# Altium project DC_controller.PrjPCB
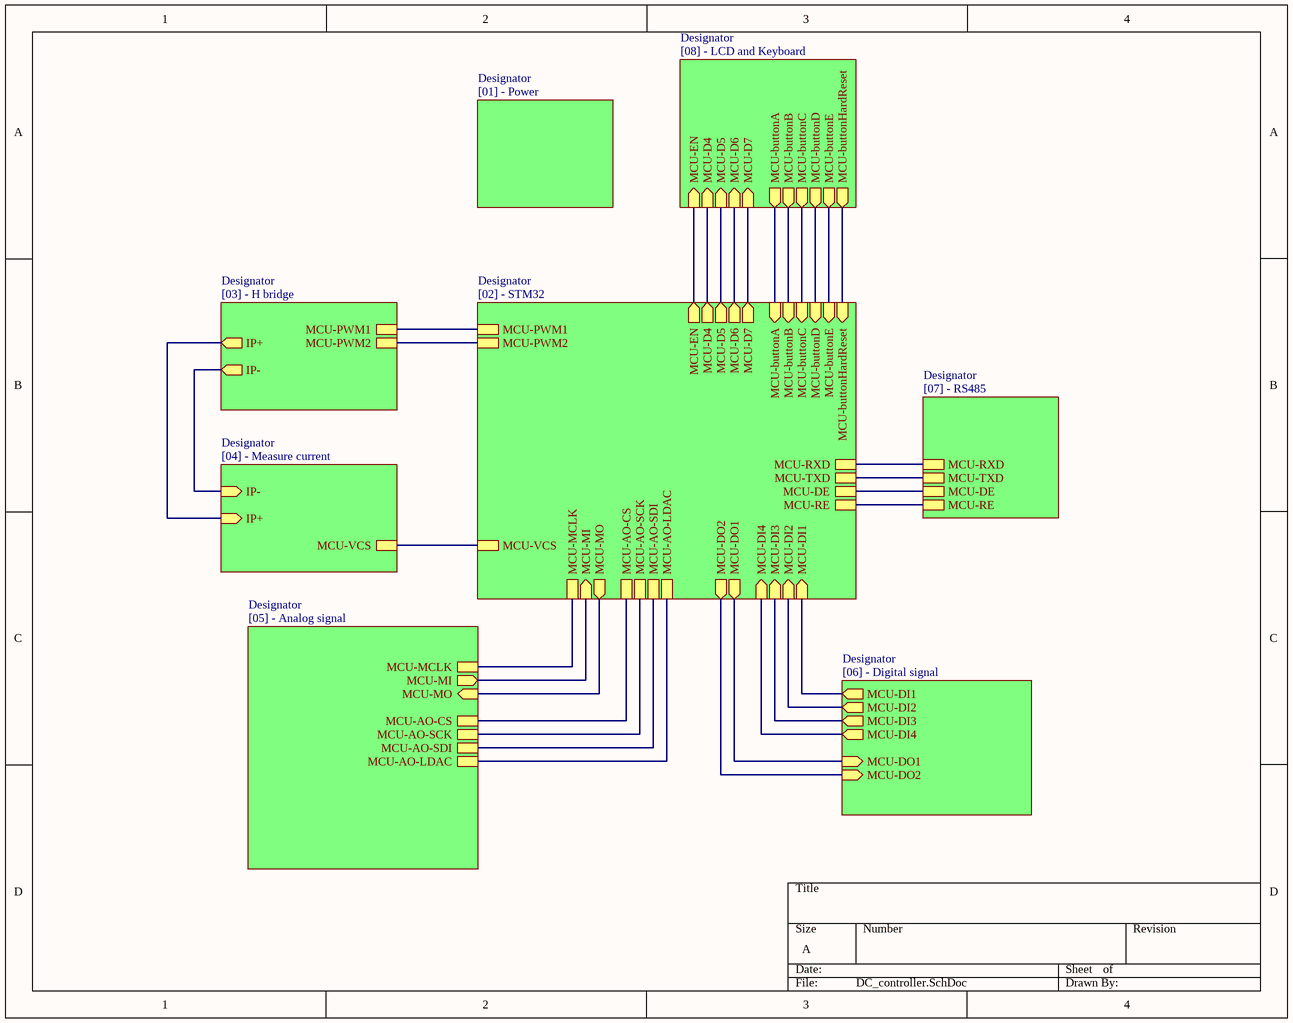
[diagram p0: DC_controller.SchDoc]
9 sheets, 199 parts. Net scope: hierarchical (ports join the sheet entries above them; power ports are global).
Sheets:
  DC_controller.SchDoc
    Designator = [01] - Power.SchDoc
    Designator = [02] - STM32.SchDoc
    Designator = [05] - Analog signal.SchDoc
    Designator = [03] - H bridge.SchDoc
    Designator = [07] - RS485.SchDoc
    Designator = [04] - Measure current.SchDoc
    Designator = [06] - Digital signal.SchDoc
    Designator = [08] - LCD and Keyboard.SchDoc

## Sheet DC_controller.SchDoc
size A

### Sub-sheets
Designator = [01] - Power: no entries
Designator = [02] - STM32: MCU-DI1 (in), MCU-DI2 (in), MCU-DO1 (out), MCU-DO2 (out), MCU-EN (out), MCU-D4 (out), MCU-D5 (out), MCU-D6 (out), MCU-D7 (out), MCU-buttonA (in), MCU-RE, MCU-DE, MCU-TXD, MCU-RXD, MCU-VCS, MCU-MCLK, MCU-MI (in), MCU-MO (out), MCU-AO-CS, MCU-AO-SCK, MCU-AO-SDI, MCU-AO-LDAC, MCU-PWM1, MCU-PWM2, MCU-DI3 (in), MCU-DI4 (in), MCU-buttonB (in), MCU-buttonC (in), MCU-buttonD (in), MCU-buttonE (in), MCU-buttonHardReset (in)
Designator = [05] - Analog signal: MCU-MCLK, MCU-MI (out), MCU-MO (in), MCU-AO-CS, MCU-AO-SCK, MCU-AO-SDI, MCU-AO-LDAC
Designator = [03] - H bridge: IP+ (out), IP- (out), MCU-PWM1, MCU-PWM2
Designator = [07] - RS485: MCU-RE, MCU-DE, MCU-TXD, MCU-RXD
Designator = [04] - Measure current: IP- (in), IP+ (in), MCU-VCS
Designator = [06] - Digital signal: MCU-DI1 (out), MCU-DI2 (out), MCU-DO1 (in), MCU-DO2 (in), MCU-DI3 (out), MCU-DI4 (out)
Designator = [08] - LCD and Keyboard: MCU-EN (in), MCU-D4 (in), MCU-D5 (in), MCU-D6 (in), MCU-D7 (in), MCU-buttonA (out), MCU-buttonB (out), MCU-buttonC (out), MCU-buttonD (out), MCU-buttonE (out), MCU-buttonHardReset (out)

### Nets
(unnamed): sheet Designator/MCU-DI1, sheet Designator/MCU-DI1
(unnamed): sheet Designator/MCU-DI2, sheet Designator/MCU-DI2
(unnamed): sheet Designator/MCU-DO1, sheet Designator/MCU-DO1
(unnamed): sheet Designator/MCU-DO2, sheet Designator/MCU-DO2
(unnamed): sheet Designator/MCU-EN, sheet Designator/MCU-EN
(unnamed): sheet Designator/MCU-D4, sheet Designator/MCU-D4
(unnamed): sheet Designator/MCU-D5, sheet Designator/MCU-D5
(unnamed): sheet Designator/MCU-D6, sheet Designator/MCU-D6
(unnamed): sheet Designator/MCU-D7, sheet Designator/MCU-D7
(unnamed): sheet Designator/MCU-buttonA, sheet Designator/MCU-buttonA
(unnamed): sheet Designator/MCU-RE, sheet Designator/MCU-RE
(unnamed): sheet Designator/MCU-DE, sheet Designator/MCU-DE
(unnamed): sheet Designator/MCU-TXD, sheet Designator/MCU-TXD
(unnamed): sheet Designator/MCU-RXD, sheet Designator/MCU-RXD
(unnamed): sheet Designator/MCU-VCS, sheet Designator/MCU-VCS
(unnamed): sheet Designator/MCU-MCLK, sheet Designator/MCU-MCLK
(unnamed): sheet Designator/MCU-MI, sheet Designator/MCU-MI
(unnamed): sheet Designator/MCU-MO, sheet Designator/MCU-MO
(unnamed): sheet Designator/MCU-AO-CS, sheet Designator/MCU-AO-CS
(unnamed): sheet Designator/MCU-AO-SCK, sheet Designator/MCU-AO-SCK
(unnamed): sheet Designator/MCU-AO-SDI, sheet Designator/MCU-AO-SDI
(unnamed): sheet Designator/MCU-AO-LDAC, sheet Designator/MCU-AO-LDAC
(unnamed): sheet Designator/MCU-PWM1, sheet Designator/MCU-PWM1
(unnamed): sheet Designator/MCU-PWM2, sheet Designator/MCU-PWM2
(unnamed): sheet Designator/MCU-DI3, sheet Designator/MCU-DI3
(unnamed): sheet Designator/MCU-DI4, sheet Designator/MCU-DI4
(unnamed): sheet Designator/MCU-buttonB, sheet Designator/MCU-buttonB
(unnamed): sheet Designator/MCU-buttonC, sheet Designator/MCU-buttonC
(unnamed): sheet Designator/MCU-buttonD, sheet Designator/MCU-buttonD
(unnamed): sheet Designator/MCU-buttonE, sheet Designator/MCU-buttonE
(unnamed): sheet Designator/MCU-buttonHardReset, sheet Designator/MCU-buttonHardReset
(unnamed): sheet Designator/IP+, sheet Designator/IP+
(unnamed): sheet Designator/IP-, sheet Designator/IP-

## Sheet [01] - Power.SchDoc
size A
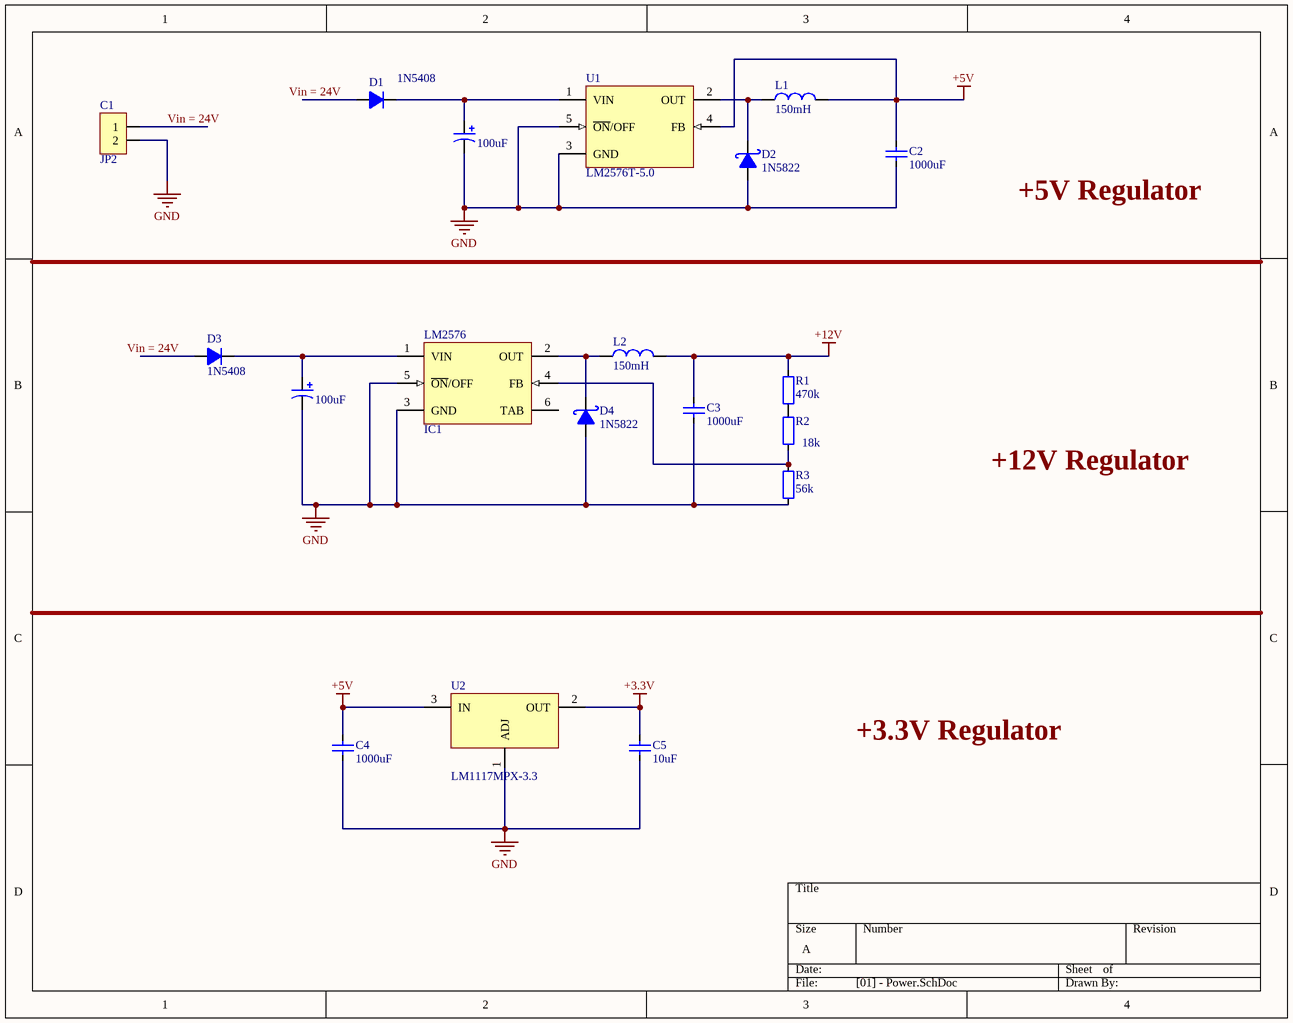
[diagram p1: [01] - Power.SchDoc]

### Parts
(Parts that share a designator on the sheet are numbered #1, #2 ... from top to bottom, then left to right.)
100uF#1  CAP_TAN_SMD  [CAP_7343]  (value not drawn)
100uF#2  CAP_TAN_SMD  [CAP_7343]  (value not drawn)
C1  JP2  [JP2-C1T]
C2  1000uF  [CAP_0402]
C3  1000uF  [CAP_0402]
C4  1000uF  [CAP_0402]
C5  10uF  [CAP_0402]
D1  1N5408  [D5A]
D2  1N5822  [D5A]
D3  1N5408  [D5A]
D4  1N5822  [D5A]
IC1  LM2576  [TS5B_N]
L1  150mH  [L/0.4]
L2  150mH  [L/0.4]
R1  470k  [RES-SMD-0805]
R2  18k  [RES-SMD-0805]
R3  56k  [RES-SMD-0805]
U1  LM2576T-5.0  [LM2576t]
U2  LM1117MPX-3.3  [LM1117-SOP]

### Nets
+3.3V: C5.2 U2.2(OUT)  [project net VCC1]
+5V: C2.2 C4.2 L1.2 U1.4(FB) U2.3(IN)
+12V: C3.2 L2.2 R1.2
GND: 100uF#1.2 100uF#2.2 C1.2 C2.1 C3.1 C4.1 C5.1 D2.1(A) D4.1(A) IC1.3(GND) IC1.5(~{ON}/OFF) R3.1 U1.3(GND) U1.5(~{ON}/OFF) U2.1(ADJ)
Vin = 24V: C1.1
Net100uF#1_1: 100uF#1.1 D1.2(K) U1.1(VIN)
Net100uF#2_1: 100uF#2.1 D3.2(K) IC1.1(VIN)
NetD2_2: D2.2(K) L1.1 U1.2(OUT)
NetD4_2: D4.2(K) IC1.2(OUT) L2.1
NetIC1_4: IC1.4(FB) R2.1 R3.2
NetR1_1: R1.1 R2.2

Not connected (* = marked no-connect by the designer): D1 1(A); D3 1(A); IC1 6(TAB)

### Notes on the sheet
- Labels drawn without touching a wire or pin: +3.3V Regulator, +5V Regulator, +12V Regulator, Vin = 24V

### Library data of the parts
100uF#1 100uF#2 = CAP_TAN_SMD: Polazied Tantalum Capacitor
C1 = JP2: WR-PHD 2.54 mm Angled Socket Header; Manufacturer: W¨¹rth Elektronik eiSos GmbH; partNo: 613002143121; ComponentLink1 Description: Manufacturer; ComponentLink2 Description: Datasheet; NoPins: 02; Created Date: 29 March 2013; ComponentLink1URL: http://www.we-online.com; ComponentLink2URL: http://katalog.we-online.de/em/datasheet/6130xx143121.pdf; Created by: Karrer Zheng
C2-C5 = CapSMD: Capacitor; Value: 33p; Published: 8-Jun-2000; LatestRevisionDate: 17-Jul-2002; LatestRevisionNote: Re-released for DXP Platform.; PackageReference: RAD-0.3; Publisher: Altium Limited
D1 D3 = D5A: Diode 5A; Value: 1N5408
D2 D4 = 1N5822: Schottky Rectifiers; Value: Diode c?m 1N5408
L1 L2 = Inductor: Value: 150 mH
R1-R3 = Resistor - SMD: Resistor; Manufacturer: Generic Components; Class: Passive; Published: 08/06/2000; Publisher: Altium Hobart Technology Centre
U1 = LM2576T-5.0: SIMPLE SWITCHER; 3A Step-Down Voltage Regulator; Manufacturer: National Semiconductor; PackageTopMarking: NSUZXYTT*LM2576T*-5.0 P+; PowerWise: N; FirstPublished: 4-Dec-2008; DatasheetVersion: Aug-2004; PackageVersion: revJ, Jan-1992; PackageReference: T05A; Publisher: Altium Limited; PackageDescription: TO-220, Molded, 5 Lead, Straight; CompType: Switcher; PartNumber: LM2576T-5.0; RoHS: O; PinCount: 5; DigiKeyPartNumber: LM2576T-5.0-ND; Code_JEDEC: TO-220-AB; ComponentLink1Description: LM2576 Datasheet; ComponentLink1URL: http://www.national.com/ds/LM/LM2576.pdf; ComponentLink2Description: LM2576 Web Page; ComponentLink2URL: http://www.national.com/pf/LM/LM2576.html; ComponentLink3Description: T05A Package Page; ComponentLink3URL: http://www.national.com/packaging/folders/t05a.html
U2 = LM1117-ADJ: 800mA Low-Dropout Linear Regulator; Creator: Nguyen Ba Bien; Website: http://group3i.net

## Sheet [02] - STM32.SchDoc
size A
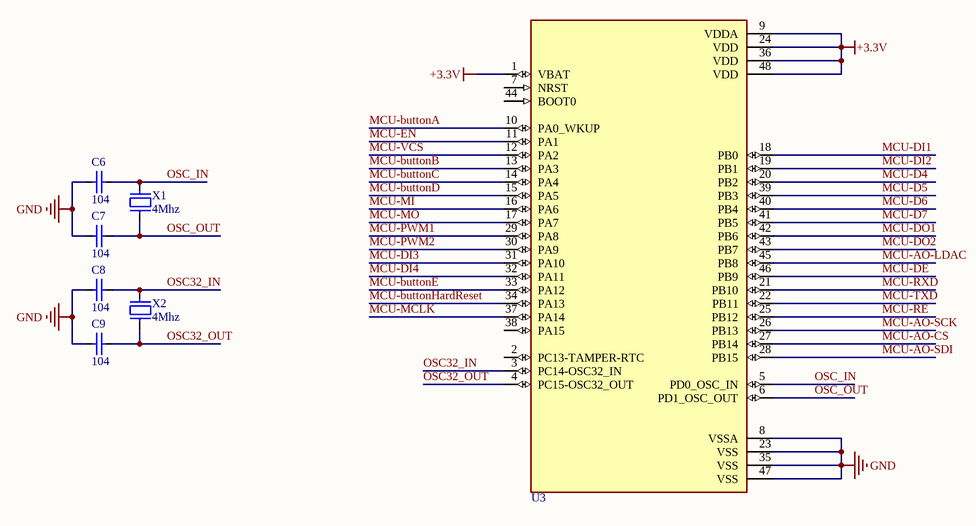
[diagram p2: [02] - STM32.SchDoc]

### Parts
C6  104  [CAP_0402]
C7  104  [CAP_0402]
C8  104  [CAP_0402]
C9  104  [CAP_0402]
U3  STM32  [LQFP 48]  (value not drawn)
X1  4Mhz  [XT2]
X2  4Mhz  [XT2]

### Nets
+3.3V: U3.1(VBAT) U3.9(VDDA) U3.24(VDD) U3.36(VDD) U3.48(VDD)  [project net VCC1]
GND: C6.1 C7.1 C8.1 C9.1 U3.8(VSSA) U3.23(VSS) U3.35(VSS) U3.47(VSS)
MCU-AO-CS: U3.27(PB14)
MCU-AO-LDAC: U3.45(PB8)
MCU-AO-SCK: U3.26(PB13)
MCU-AO-SDI: U3.28(PB15)
MCU-buttonA: U3.10(PA0_WKUP)
MCU-buttonB: U3.13(PA3)
MCU-buttonC: U3.14(PA4)
MCU-buttonD: U3.15(PA5)
MCU-buttonE: U3.33(PA12)
MCU-buttonHardReset: U3.34(PA13)
MCU-D4: U3.20(PB2)
MCU-D5: U3.39(PB3)
MCU-D6: U3.40(PB4)
MCU-D7: U3.41(PB5)
MCU-DE: U3.46(PB9)
MCU-DI1: U3.18(PB0)
MCU-DI2: U3.19(PB1)
MCU-DI3: U3.31(PA10)
MCU-DI4: U3.32(PA11)
MCU-DO1: U3.42(PB6)
MCU-DO2: U3.43(PB7)
MCU-EN: U3.11(PA1)
MCU-MCLK: U3.37(PA14)
MCU-MI: U3.16(PA6)
MCU-MO: U3.17(PA7)
MCU-PWM1: U3.29(PA8)
MCU-PWM2: U3.30(PA9)
MCU-RE: U3.25(PB12)
MCU-RXD: U3.21(PB10)
MCU-TXD: U3.22(PB11)
MCU-VCS: U3.12(PA2)
OSC32_IN: C8.2 U3.3(PC14-OSC32_IN) X2.2
OSC32_OUT: C9.2 U3.4(PC15-OSC32_OUT) X2.1
OSC_IN: C6.2 U3.5(PD0_OSC_IN) X1.2
OSC_OUT: C7.2 U3.6(PD1_OSC_OUT) X1.1

Not connected (* = marked no-connect by the designer): U3 2(PC13-TAMPER-RTC) 7(NRST) 38(PA15) 44(BOOT0)

### Library data of the parts
C6-C9 = CapSMD: Capacitor; Value: 33p; Published: 8-Jun-2000; LatestRevisionDate: 17-Jul-2002; LatestRevisionNote: Re-released for DXP Platform.; PackageReference: RAD-0.3; Publisher: Altium Limited
U3 = STM32F103C8T6: STM32 ARM-based 32-bit MCU with 64 Kbytes Flash, 64-pin LQFP, Industrial Temperature
X1 X2 = XT2: Crystal For all Crystal 2pin.; Value: 4Mhz

## Sheet [05] - Analog signal.SchDoc
size A
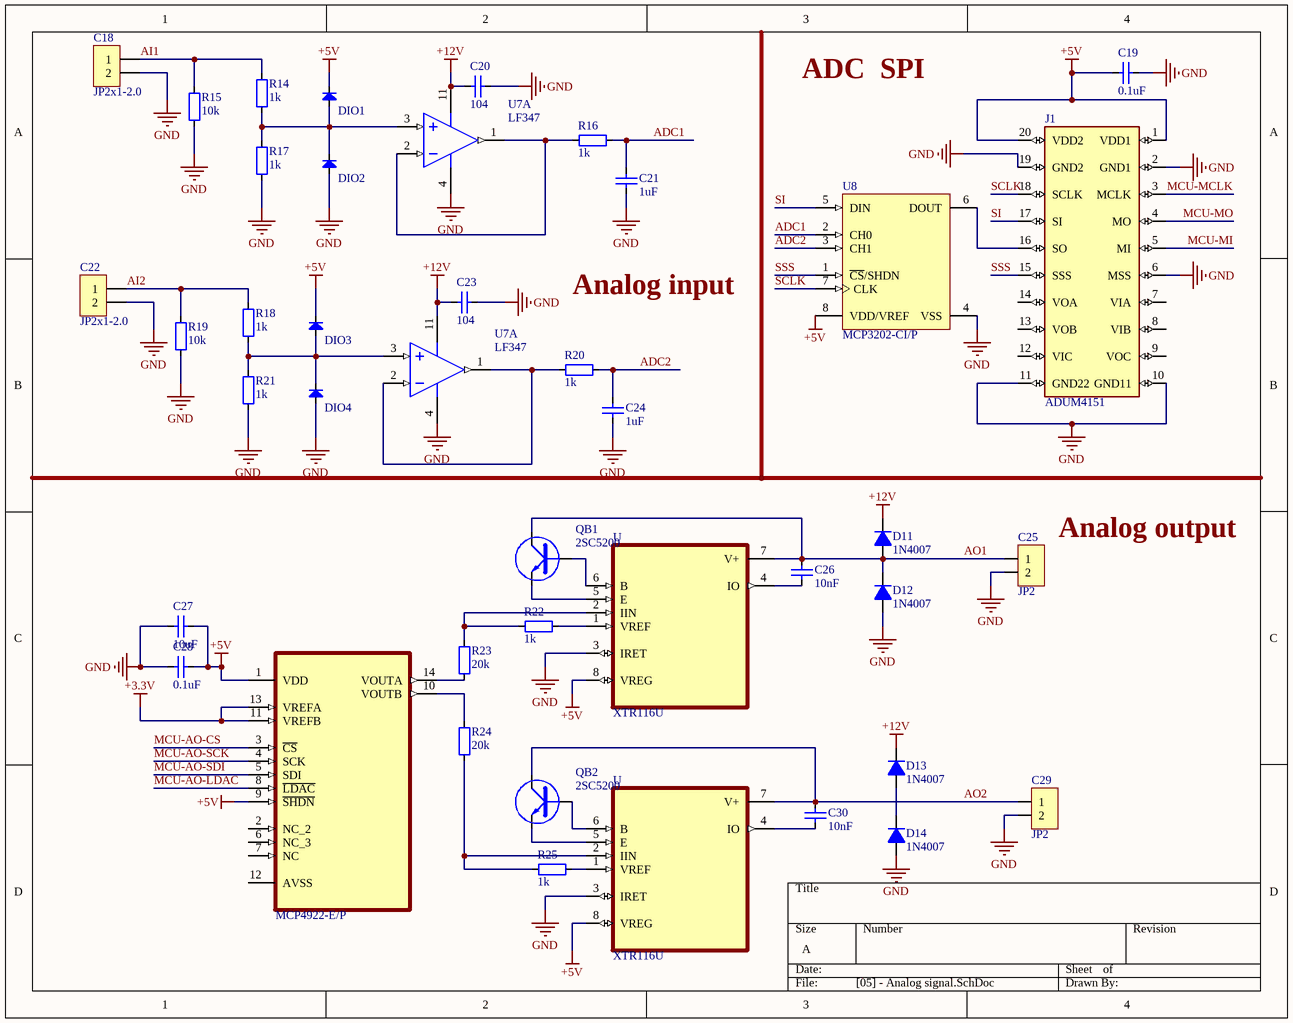
[diagram p3: [05] - Analog signal.SchDoc]

### Parts
(Parts that share a designator on the sheet are numbered #1, #2 ... from top to bottom, then left to right.)
?  MCP4922-E/P  [DIP254P762X533-14]
C18  JP2x1-2.0  [J2-C1T]
C19  0.1uF  [CAP_0402]
C20  104  [CAP_0402]
C21  1uF  [CAP_0402]
C22  JP2x1-2.0  [J2-C1T]
C23  104  [CAP_0402]
C24  1uF  [CAP_0402]
C25  JP2  [JP2-C1T]
C26  10nF  [CAP_0402]
C27  10uF  [CAP_0402]
C28  0.1uF  [CAP_0402]
C29  JP2  [JP2-C1T]
C30  10nF  [CAP_0402]
D11  1N4007  [D1A]
D12  1N4007  [D1A]
D13  1N4007  [D1A]
D14  1N4007  [D1A]
DIO1  Diode SMD  [DO-214AB(SMC)]  (value not drawn)
DIO2  Diode SMD  [DO-214AB(SMC)]  (value not drawn)
DIO3  Diode SMD  [DO-214AB(SMC)]  (value not drawn)
DIO4  Diode SMD  [DO-214AB(SMC)]  (value not drawn)
J1  ADUM4151  [SOIC20R]
QB1  2SC5200  [2SC5200]
QB2  2SC5200  [2SC5200]
R14  1k  [RES-SMD-0101]
R15  10k  [RES-SMD-0101]
R16  1k  [RES-SMD-0101]
R17  1k  [RES-SMD-0101]
R18  1k  [RES-SMD-0101]
R19  10k  [RES-SMD-0101]
R20  1k  [RES-SMD-0101]
R21  1k  [RES-SMD-0101]
R22  1k  [RES-SMD-0101]
R23  20k  [RES-SMD-0805]
R24  20k  [RES-SMD-0805]
R25  1k  [RES-SMD-0101]
U7#1  LF347  [SO14]  (part A of 4)
U7#2  LF347  [SO14]  (part A of 4)
U8  MCP3202-CI/P  [PDIP300-P8]
U#1  XTR116U  [SOIC127P599X175-8N]
U#2  XTR116U  [SOIC127P599X175-8N]

### Nets
+3.3V: ?.11(VREFB) ?.13(VREFA)  [project net VCC1]
+5V: ?.1(VDD) ?.9(~{SHDN}) C19.1 C27.2 C28.2 DIO1.2(K) DIO3.2(K) J1.1(VDD1) J1.20(VDD2) U8.8(VDD/VREF) U#1.8(VREG) U#2.8(VREG)
+12V: C20.1 C23.1 D11.2(K) D13.2(K) U7#1.11(VEE) U7#2.11(VEE)
GND: C18.2 C19.2 C20.2 C21.1 C22.2 C23.2 C24.1 C25.2 C27.1 C28.1 C29.2 D12.1(A) D14.1(A) DIO2.1(A) DIO4.1(A) J1.2(GND1) J1.6(MSS) J1.10(GND11) J1.11(GND22) J1.19(GND2) R15.1 R17.1 R19.1 R21.1 U7#1.4(VCC) U7#2.4(VCC) U8.4(VSS) U#1.3(IRET) U#2.3(IRET)
ADC1: C21.2 R16.1 U8.2(CH0)
ADC2: C24.2 R20.1 U8.3(CH1)
AI1: C18.1 R14.2 R15.2
AI2: C22.1 R18.2 R19.2
AO1: C25.1 C26.2 D11.1(A) D12.2(K) QB1.2(C) U#1.7(V+)
AO2: C29.1 C30.2 QB2.2(C) U#2.7(V+)
MCU-AO-CS: ?.3(~{CS})
MCU-AO-LDAC: ?.8(~{LDAC})
MCU-AO-SCK: ?.4(SCK)
MCU-AO-SDI: ?.5(SDI)
MCU-MCLK: J1.3(MCLK)
MCU-MI: J1.5(MI)
MCU-MO: J1.4(MO)
SCLK: J1.18(SCLK) U8.7(CLK)
SI: J1.17(SI) U8.5(DIN)
SSS: J1.15(SSS) U8.1(~{CS}/SHDN)
Net?_10: ?.10(VOUTB) R24.2
Net?_14: ?.14(VOUTA) R23.1
NetC26_1: C26.1 U#1.4(IO)
NetC30_1: C30.1 U#2.4(IO)
NetD13_1: D13.1(A) D14.2(K)
NetDIO1_1: DIO1.1(A) DIO2.2(K) R14.1 R17.2 U7#1.3(1_IN+)
NetDIO3_1: DIO3.1(A) DIO4.2(K) R18.1 R21.2 U7#2.3(1_IN+)
NetJ1_16: J1.16(SO) U8.6(DOUT)
NetQB1_1: QB1.1(B) U#1.6(B)
NetQB1_3: QB1.3(E) U#1.5(E)
NetQB2_1: QB2.1(B) U#2.6(B)
NetQB2_3: QB2.3(E) U#2.5(E)
NetR16_2: R16.2 U7#1.1(1_OUT) U7#1.2(1_IN-)
NetR20_2: R20.2 U7#2.1(1_OUT) U7#2.2(1_IN-)
NetR22_1: R22.1 R23.2 U#1.2(IIN)
NetR22_2: R22.2 U#1.1(VREF)
NetR24_1: R24.1 R25.1 U#2.2(IIN)
NetR25_2: R25.2 U#2.1(VREF)

Not connected (* = marked no-connect by the designer): ? 2(NC_2) 6(NC_3) 7(NC) 12(AVSS); J1 7(VIA) 8(VIB) 9(VOC) 12(VIC) 13(VOB) 14(VOA)

### Notes on the sheet
- Labels drawn without touching a wire or pin: ADC  SPI, Analog input, Analog output

### Library data of the parts
? = MCP4922-E/P: 12 Bit Digital to Analog Converter 2 14-PDIP; MF: Microchip; Price: None; Availability: Unavailable; SnapEDA_Link: https://www.snapeda.com/parts/MCP4922-E/P/Microchip/view-part/43393/?ref=snap; MP: MCP4922-E/P; Value: *; Package: DIP-14 Microchip
C18 C22 = JP2x1-2.0: WR-PHD 2.00 mm Socket Header; Manufacturer: W¨¹rth Elektronik eiSos GmbH; partNo: 62000211821; ComponentLink1 Description: Manufacturer; ComponentLink2 Description: Datasheet; NoPins: 02; Created Date: 2 April 2013; ComponentLink1URL: http://www.we-online.com; ComponentLink2URL: http://katalog.we-online.de/em/datasheet/6200xx11821.pdf; Created by: Karrer Zheng
C19-C21 C23 C24 C26-C28 C30 = CapSMD: Capacitor; Value: 33p; Published: 8-Jun-2000; LatestRevisionDate: 17-Jul-2002; LatestRevisionNote: Re-released for DXP Platform.; PackageReference: RAD-0.3; Publisher: Altium Limited
C25 C29 = JP2: as C1 on sheet [01] - Power; Created Date: 29 March 2013; ComponentLink1URL: http://www.we-online.com; ComponentLink2URL: http://katalog.we-online.de/em/datasheet/6130xx143121.pdf; Created by: Karrer Zheng
D11-D14 = D1A: Diode 1A; Value: 1N4007
DIO1-DIO4 = Diode SMD: Default Diode; Code - JEDEC: DO-214-AB; Value: 1N5007; Published: 8-Jun-2000; Revision: July-2002: Re-released for DXP Platform.; Publisher: Altium Limited
J1 = ADUM4151: ADI 7 Ch, Isolator for SPI Interface; MF: Analog Devices; Price: None; SnapEDA_Link: https://www.snapeda.com/parts/ADUM4151/Analog%20Devices/view-part/5010508/?ref=snap; Availability: Bad; Value: *; MP: ADUM4151; Package: None; Check_prices: https://www.snapeda.com/parts/ADUM4151/Analog%20Devices/view-part/5010508/?ref=eda
QB1 QB2 = 2SC5200: Transistor Power Supply; Value: D718
R14-R25 = Resistor - SMD: as R1 on sheet [01] - Power; Published: 08/06/2000; Publisher: Altium Hobart Technology Centre
U7#1 U7#2 = LF347: Low Power Quad Operational Amplifier; Manufacturer Part Number: LF347BD; Manufacturer: Texas Instruments; Text Field1: pristel=Nsc\nsanopea\<parttype>.ckt; Slew Rate: 13 V/µs; Voltage - Supply, Single/Dual (±): 7 V ~ 36 V, ±3.5 V ~ 18 V; Current - Input Bias: 50pA; Voltage - Input Offset: 3000µV; Number of Circuits: 4; Gain Bandwidth Product: 3MHz; Amplifier Type: J-FET; Current - Supply: 8mA; Supplier 1: Digi-Key; Supplier Part Number 1: 296-7136-5-ND; Package / Case: 14-SOIC (3.9mm Width), 14-SOL; Supplier: Digi-Key; Current - Output / Channel: -; Packaging: Tube; RoHS: RoHS Compliant; Output Type: -; Operating Temperature: 0°C ~ 70°C; Category: Integrated Circuits (ICs); Supplier Part Number: 296-7136-5-ND
U8 = MCP3202-CI/P: 2.7V Dual Channel 12-Bit A/D Converter with SPI Serial Interface, 8-Pin PDIP, C Performance Grade, Industrial Temperature; Code_JEDEC: MS-001; PackageVersion: revBB, Aug-2009; PackageReference: PDIP300-P8; PackageDescription: 8-Lead Plastic Dual In-Line (P) - 300 mil Body [PDIP]; DatasheetVersion: revE, Dec-2008; PartNumber: MCP3202-CI/P
U#1 U#2 = XTR116U: 4-20mA Current Loop Transmitter with 4.096-V reference and 200-?A power 8-SOIC -40 to 85; MF: Texas Instruments; Package: SOIC-8 Texas Instruments; DigiKey-Purchase-URL: https://snapeda.com/shop?store=DigiKey&id=485469; MP: XTR116U; Value: *; Price: None; Texas_Instruments-Purchase-URL: https://snapeda.com/shop?store=Texas+Instruments&id=485469; Availability: Warning; SnapEDA_Link: https://www.snapeda.com/parts/XTR116U/Texas%20Instruments/view-part/485469/?ref=snap; Mouser-Purchase-URL: https://snapeda.com/shop?store=Mouser&id=485469
  U#2: BuyPart: https://www.snapeda.com/parts/XTR116U/Texas%20Instruments/view-part/485469/?ref=eda

## Sheet [03] - H bridge.SchDoc
size A
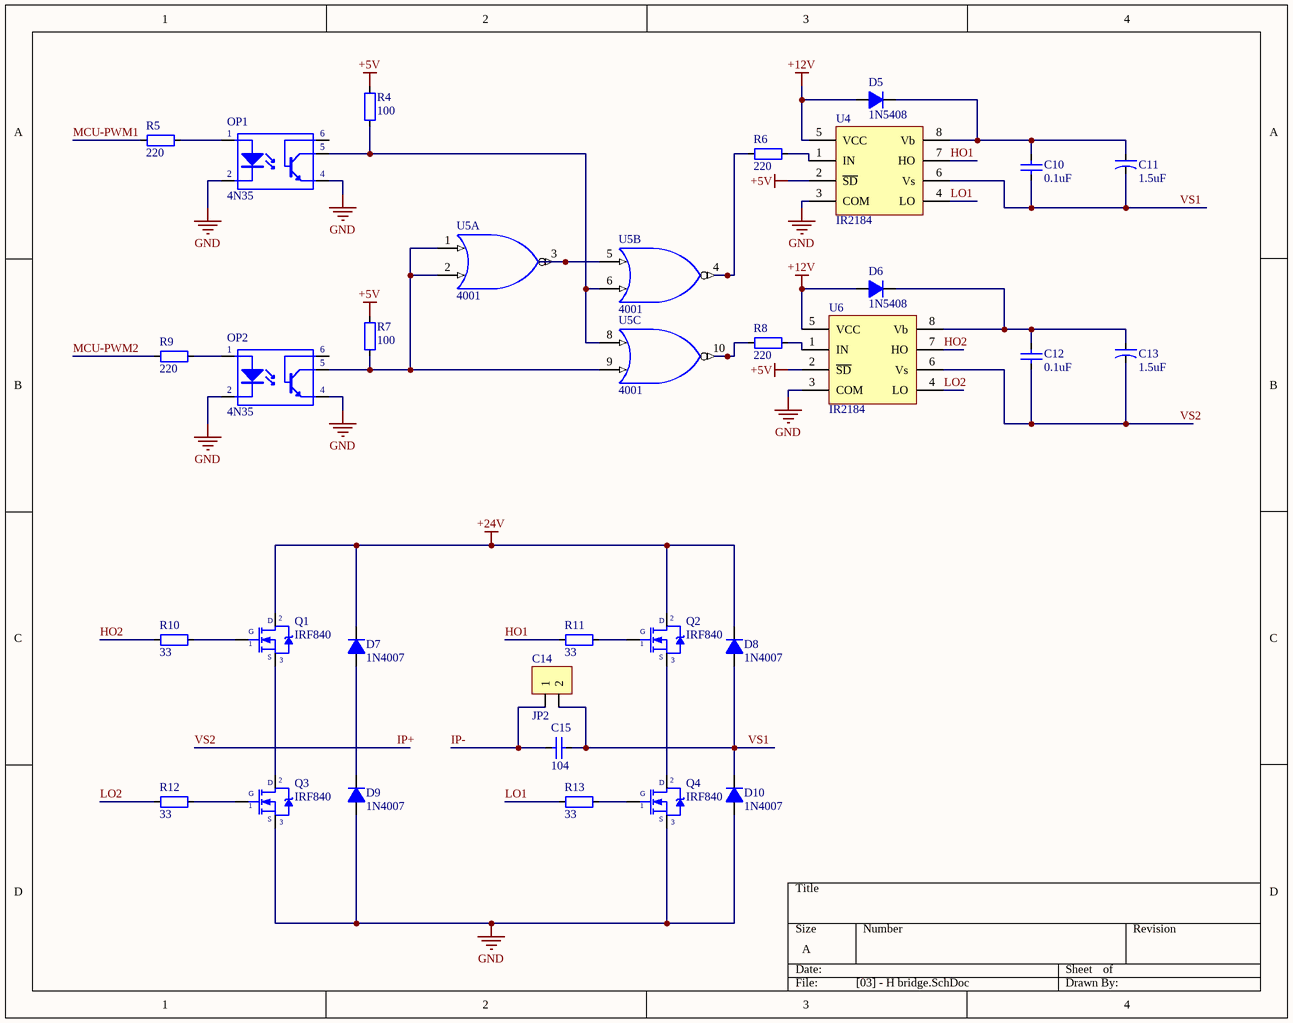
[diagram p4: [03] - H bridge.SchDoc]

### Parts
C10  0.1uF  [CAP_0402]
C11  1.5uF  [CAP-ALU-SMD-4.5x5x1.4]
C12  0.1uF  [CAP_0402]
C13  1.5uF  [CAP-ALU-SMD-4.5x5x1.4]
C14  JP2  [JP2-C1T]
C15  104  [CAP_0805]
D5  1N5408  [D5A]
D6  1N5408  [D5A]
D7  1N4007  [D1A]
D8  1N4007  [D1A]
D9  1N4007  [D1A]
D10  1N4007  [D1A]
OP1  4N35  [DIP6/W0.3]
OP2  4N35  [DIP6/W0.3]
Q1  IRF840  [QTO-220]
Q2  IRF840  [QTO-220]
Q3  IRF840  [QTO-220]
Q4  IRF840  [QTO-220]
R4  100  [RES-SMD-0805]
R5  220  [RES-SMD-0805]
R6  220  [RES-SMD-0101]
R7  100  [RES-SMD-0805]
R8  220  [RES-SMD-0101]
R9  220  [RES-SMD-0805]
R10  33  [RES-SMD-0101]
R11  33  [RES-SMD-0101]
R12  33  [RES-SMD-0101]
R13  33  [RES-SMD-0101]
U4  IR2184  [DIP8]
U5  4001  [SO14]  (parts A,B,C of 4)
U6  IR2184  [DIP8]

### Nets
+5V: R4.2 R7.2 U4.2(~{SD}) U6.2(~{SD})
+12V: D5.1(A) D6.1(A) U4.5(VCC) U6.5(VCC)
+24V: D7.2(K) D8.2(K) Q1.2(D) Q2.2(D)
GND: D9.1(A) D10.1(A) OP1.2(K) OP1.4(E) OP2.2(K) OP2.4(E) Q3.3(S) Q4.3(S) U4.3(COM) U5.7(GND) U6.3(COM)
VCC: U5.14(VCC)
HO1: R11.1 U4.7(HO)
HO2: R10.1 U6.7(HO)
IP+: C12.1 C13.2 U6.6(Vs)  [also labelled VS2]
IP-: C14.1 C15.1
LO1: R13.1 U4.4(LO)
LO2: R12.1 U6.4(LO)
MCU-PWM1: R5.1
MCU-PWM2: R9.1
VS1: C10.1 C11.2 C14.2 C15.2 D8.1(A) D10.2(K) U4.6(Vs)
NetC10_2: C10.2 C11.1 D5.2(K) U4.8(Vb)
NetC12_2: C12.2 C13.1 D6.2(K) U6.8(Vb)
NetD7_1: D7.1(A) D9.2(K)
NetOP1_1: OP1.1(A) R5.2
NetOP1_5: OP1.5(C) R4.1 U5.6 U5.8
NetOP2_1: OP2.1(A) R9.2
NetOP2_5: OP2.5(C) R7.1 U5.1 U5.2 U5.9
NetQ1_1: Q1.1(G) R10.2
NetQ1_3: Q1.3(S) Q3.2(D)
NetQ2_1: Q2.1(G) R11.2
NetQ2_3: Q2.3(S) Q4.2(D)
NetQ3_1: Q3.1(G) R12.2
NetQ4_1: Q4.1(G) R13.2
NetR6_1: R6.1 U5.4
NetR6_2: R6.2 U4.1(IN)
NetR8_1: R8.1 U5.10
NetR8_2: R8.2 U6.1(IN)
NetU5_3: U5.3 U5.5

Not connected (* = marked no-connect by the designer): OP1 6(C); OP2 6(C)

### Library data of the parts
C10 C12 C15 = CapSMD: Capacitor; Value: 33p; Published: 8-Jun-2000; LatestRevisionDate: 17-Jul-2002; LatestRevisionNote: Re-released for DXP Platform.; PackageReference: RAD-0.3; Publisher: Altium Limited
C11 C13 = CAP-ALU-SMD: Polarized Capacitor (Axial); Published: 8-Jun-2000; LatestRevisionDate: 17-Jul-2002; LatestRevisionNote: Re-released for DXP Platform.; PackageReference: POLAR0.8; Publisher: Altium Limited
C14 = JP2: as C1 on sheet [01] - Power; Created Date: 29 March 2013; ComponentLink1URL: http://www.we-online.com; ComponentLink2URL: http://katalog.we-online.de/em/datasheet/6130xx143121.pdf; Created by: Karrer Zheng
D5 D6 = D5A: Diode 5A; Value: 1N5408
D7-D10 = D1A: Diode 1A; Value: 1N4007
OP1 OP2 = 4N35: Opto; Value: 4N35
Q1-Q4 = IRF840: MOSFET N - CHANNEL 500V - 0.75 - 8A - TO-220; Value: IRF840
R4-R13 = Resistor - SMD: as R1 on sheet [01] - Power; Published: 08/06/2000; Publisher: Altium Hobart Technology Centre
U4 U6 = IR2184: Half-Bridge Driver
U5 = 4001: Quad 2-INPUT NOR GATE

## Sheet [07] - RS485.SchDoc
size A
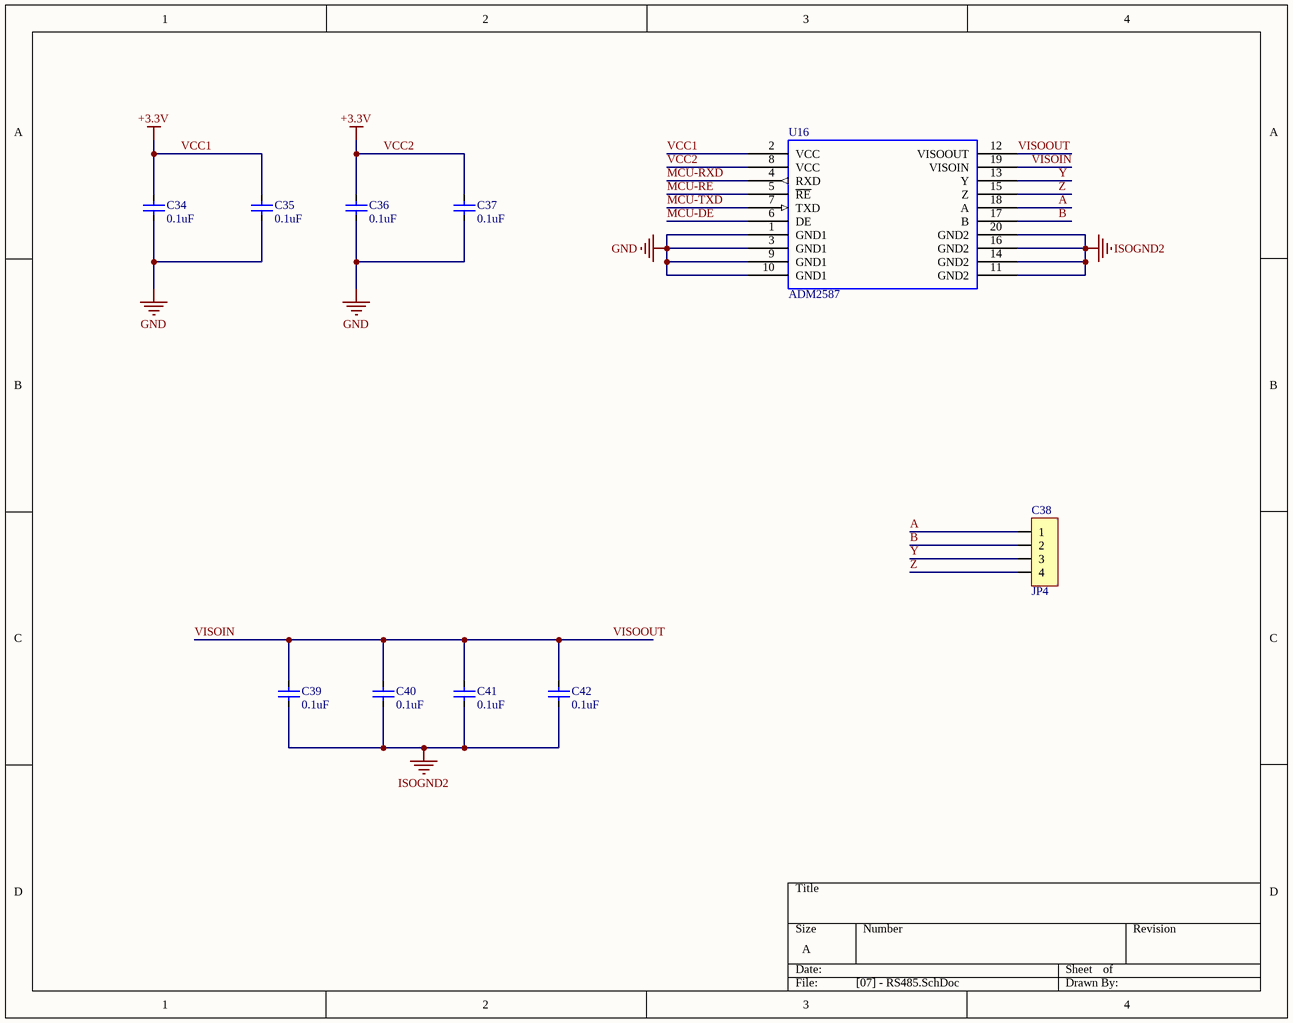
[diagram p5: [07] - RS485.SchDoc]

### Parts
C34  0.1uF  [CAP_0402]
C35  0.1uF  [CAP_0402]
C36  0.1uF  [CAP_0402]
C37  0.1uF  [CAP_0402]
C38  JP4  [JP4-C1T]
C39  0.1uF  [CAP_0402]
C40  0.1uF  [CAP_0402]
C41  0.1uF  [CAP_0402]
C42  0.1uF  [CAP_0402]
U16  ADM2587  [ADM2587]

### Nets
GND: C34.1 C35.1 C36.1 C37.1 U16.1(GND1) U16.3(GND1) U16.9(GND1) U16.10(GND1)
ISOGND2: C39.1 C40.1 C41.1 C42.1 U16.11(GND2) U16.14(GND2) U16.16(GND2) U16.20(GND2)
VCC1: C34.2 C35.2 C36.2 C37.2 U16.2(VCC) U16.8(VCC)  [also labelled +3.3V, VCC2]
A: C38.1 U16.18(A)
B: C38.2 U16.17(B)
MCU-DE: U16.6(DE)
MCU-RE: U16.5(~{RE})
MCU-RXD: U16.4(RXD)
MCU-TXD: U16.7(TXD)
VISOIN: C39.2 C40.2 C41.2 C42.2 U16.12(VISOOUT) U16.19(VISOIN)  [also labelled VISOOUT]
Y: C38.3 U16.13(Y)
Z: C38.4 U16.15(Z)

### Library data of the parts
C34-C37 C39-C42 = CapSMD: Capacitor; Value: 33p; Published: 8-Jun-2000; LatestRevisionDate: 17-Jul-2002; LatestRevisionNote: Re-released for DXP Platform.; PackageReference: RAD-0.3; Publisher: Altium Limited
C38 = JP4: WR-PHD 2.54 mm Angled Socket Header; Manufacturer: W¨¹rth Elektronik eiSos GmbH; partNo: 613004143121; ComponentLink1 Description: Manufacturer; ComponentLink2 Description: Datasheet; NoPins: 04; Created Date: 29 March 2013; ComponentLink1URL: http://www.we-online.com; ComponentLink2URL: http://katalog.we-online.de/em/datasheet/6130xx143121.pdf; Created by: Karrer Zheng

## Sheet [04] - Measure current.SchDoc
size A
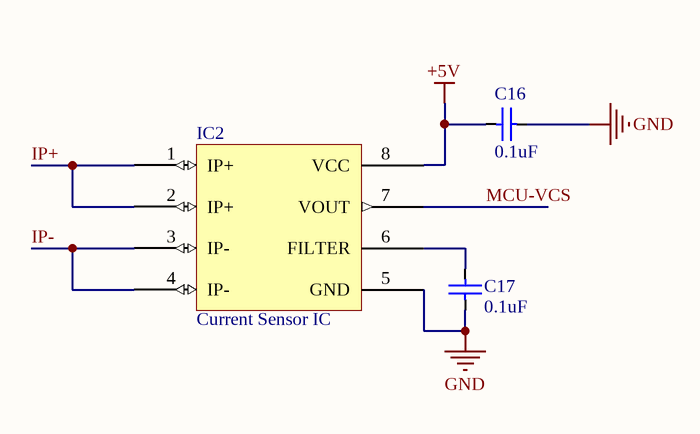
[diagram p6: [04] - Measure current.SchDoc]

### Parts
C16  0.1uF  [CAP_0805]
C17  0.1uF  [CAP_0805]
IC2  Current Sensor IC  [SOIC-8]

### Nets
+5V: C16.1 IC2.8(VCC)
GND: C16.2 C17.1 IC2.5(GND)
IP+: IC2.1(IP+) IC2.2(IP+)
IP-: IC2.3(IP-) IC2.4(IP-)
MCU-VCS: IC2.7(VOUT)
NetC17_2: C17.2 IC2.6(FILTER)

### Library data of the parts
C16 C17 = CapSMD: Capacitor; Value: 33p; Published: 8-Jun-2000; LatestRevisionDate: 17-Jul-2002; LatestRevisionNote: Re-released for DXP Platform.; PackageReference: RAD-0.3; Publisher: Altium Limited
IC2 = ACS712

## Sheet [06] - Digital signal.SchDoc
size A
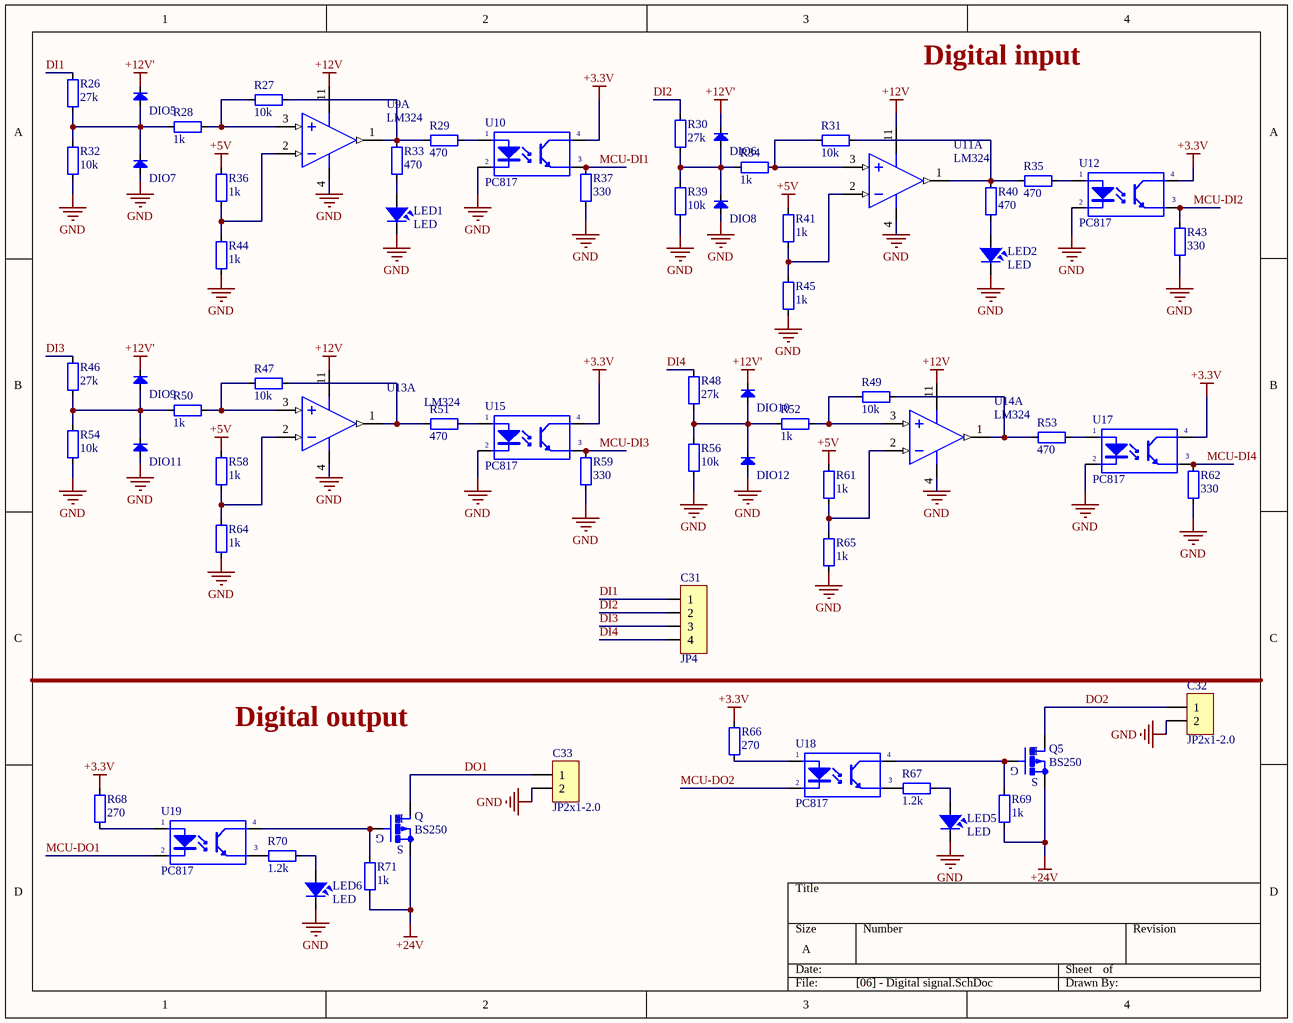
[diagram p7: [06] - Digital signal.SchDoc]

### Parts
C31  JP4  [JP4-C1T]
C32  JP2x1-2.0  [J2-C1T]
C33  JP2x1-2.0  [J2-C1T]
DIO5  Diode SMD  [DO-214AB(SMC)]  (value not drawn)
DIO6  Diode SMD  [DO-214AB(SMC)]  (value not drawn)
DIO7  Diode SMD  [DO-214AB(SMC)]  (value not drawn)
DIO8  Diode SMD  [DO-214AB(SMC)]  (value not drawn)
DIO9  Diode SMD  [DO-214AB(SMC)]  (value not drawn)
DIO10  Diode SMD  [DO-214AB(SMC)]  (value not drawn)
DIO11  Diode SMD  [DO-214AB(SMC)]  (value not drawn)
DIO12  Diode SMD  [DO-214AB(SMC)]  (value not drawn)
LED1  LED  [LED-3]
LED2  LED  [LED-3]
LED5  LED  [LED-3]
LED6  LED  [LED-3]
Q  BS250  [SOT54E]
Q5  BS250  [SOT54E]
R26  27k  [RES-SMD-0101]
R27  10k  [RES-SMD-0101]
R28  1k  [RES-SMD-0101]
R29  470  [RES-SMD-0101]
R30  27k  [RES-SMD-0101]
R31  10k  [RES-SMD-0101]
R32  10k  [RES-SMD-0101]
R33  470  [RES-SMD-0101]
R34  1k  [RES-SMD-0101]
R35  470  [RES-SMD-0101]
R36  1k  [RES-SMD-0101]
R37  330  [RES-SMD-0101]
R39  10k  [RES-SMD-0101]
R40  470  [RES-SMD-0101]
R41  1k  [RES-SMD-0101]
R43  330  [RES-SMD-0101]
R44  1k  [RES-SMD-0101]
R45  1k  [RES-SMD-0101]
R46  27k  [RES-SMD-0101]
R47  10k  [RES-SMD-0101]
R48  27k  [RES-SMD-0101]
R49  10k  [RES-SMD-0101]
R50  1k  [RES-SMD-0101]
R51  470  [RES-SMD-0101]
R52  1k  [RES-SMD-0101]
R53  470  [RES-SMD-0101]
R54  10k  [RES-SMD-0101]
R56  10k  [RES-SMD-0101]
R58  1k  [RES-SMD-0101]
R59  330  [RES-SMD-0101]
R61  1k  [RES-SMD-0101]
R62  330  [RES-SMD-0101]
R64  1k  [RES-SMD-0101]
R65  1k  [RES-SMD-0101]
R66  270  [RES-SMD-0101]
R67  1.2k  [RES-SMD-0101]
R68  270  [RES-SMD-0101]
R69  1k  [RES-SMD-0101]
R70  1.2k  [RES-SMD-0101]
R71  1k  [RES-SMD-0101]
U9  LM324  [SO14]  (part A of 4)
U10  PC817  [DIP4/W0.3]
U11  LM324  [SO14]  (part A of 4)
U12  PC817  [DIP4/W0.3]
U13  LM324  [SO14]  (part A of 4)
U14  LM324  [SO14]  (part A of 4)
U15  PC817  [DIP4/W0.3]
U17  PC817  [DIP4/W0.3]
U18  PC817  [DIP4/W0.3]
U19  PC817  [DIP4/W0.3]

### Nets
+3.3V: R66.2 R68.2 U10.4(C) U12.4(C) U15.4(C) U17.4(C)  [project net VCC1]
+5V: R36.1 R41.1 R58.1 R61.1
+12V: U9.11(VEE) U11.11(VEE) U13.11(VEE) U14.11(VEE)
+12V': DIO5.2(K) DIO6.2(K) DIO9.2(K) DIO10.2(K)
+24V: Q.S Q5.S R69.2 R71.2
GND: C32.2 C33.2 DIO7.1(A) DIO8.1(A) DIO11.1(A) DIO12.1(A) LED1.2 LED2.2 LED5.2 LED6.2 R32.1 R37.2 R39.1 R43.2 R44.2 R45.2 R54.1 R56.1 R59.2 R62.2 R64.2 R65.2 U9.4(VCC) U10.2(K) U11.4(VCC) U12.2(K) U13.4(VCC) U14.4(VCC) U15.2(K) U17.2(K)
DI1: C31.1 R26.2
DI2: C31.2 R30.2
DI3: C31.3 R46.2
DI4: C31.4 R48.2
DO1: C33.1 Q.D
DO2: C32.1 Q5.D
MCU-DI1: R37.1 U10.3(E)
MCU-DI2: R43.1 U12.3(E)
MCU-DI3: R59.1 U15.3(E)
MCU-DI4: R62.1 U17.3(E)
MCU-DO1: U19.2(K)
MCU-DO2: U18.2(K)
NetDIO5_1: DIO5.1(A) DIO7.2(K) R26.1 R28.2 R32.2
NetDIO6_1: DIO6.1(A) DIO8.2(K) R30.1 R34.2 R39.2
NetDIO9_1: DIO9.1(A) DIO11.2(K) R46.1 R50.2 R54.2
NetDIO10_1: DIO10.1(A) DIO12.2(K) R48.1 R52.2 R56.2
NetLED1_1: LED1.1 R33.2
NetLED2_1: LED2.1 R40.2
NetLED5_1: LED5.1 R67.1
NetLED6_1: LED6.1 R70.1
NetQ5_G: Q5.G R69.1 U18.4(C)
NetQ_G: Q.G R71.1 U19.4(C)
NetR27_1: R27.1 R29.2 R33.1 U9.1(1_OUT)
NetR27_2: R27.2 R28.1 U9.3(1_IN+)
NetR29_1: R29.1 U10.1(A)
NetR31_1: R31.1 R35.2 R40.1 U11.1(1_OUT)
NetR31_2: R31.2 R34.1 U11.3(1_IN+)
NetR35_1: R35.1 U12.1(A)
NetR36_2: R36.2 R44.1 U9.2(1_IN-)
NetR41_2: R41.2 R45.1 U11.2(1_IN-)
NetR47_1: R47.1 R51.2 U13.1(1_OUT)
NetR47_2: R47.2 R50.1 U13.3(1_IN+)
NetR49_1: R49.1 R53.2 U14.1(1_OUT)
NetR49_2: R49.2 R52.1 U14.3(1_IN+)
NetR51_1: R51.1 U15.1(A)
NetR53_1: R53.1 U17.1(A)
NetR58_2: R58.2 R64.1 U13.2(1_IN-)
NetR61_2: R61.2 R65.1 U14.2(1_IN-)
NetR66_1: R66.1 U18.1(A)
NetR67_2: R67.2 U18.3(E)
NetR68_1: R68.1 U19.1(A)
NetR70_2: R70.2 U19.3(E)

### Notes on the sheet
- Digital input
- Digital output

### Library data of the parts
C31 = JP4: as C38 on sheet [07] - RS485; Created Date: 29 March 2013; ComponentLink1URL: http://www.we-online.com; ComponentLink2URL: http://katalog.we-online.de/em/datasheet/6130xx143121.pdf; Created by: Karrer Zheng
C32 C33 = JP2x1-2.0: as C18 on sheet [05] - Analog signal; Created Date: 2 April 2013; ComponentLink1URL: http://www.we-online.com; ComponentLink2URL: http://katalog.we-online.de/em/datasheet/6200xx11821.pdf; Created by: Karrer Zheng
DIO5-DIO12 = Diode SMD: as DIO1 on sheet [05] - Analog signal; Published: 8-Jun-2000; Revision: July-2002: Re-released for DXP Platform.; Publisher: Altium Limited
LED1 LED2 LED5 LED6 = LED: LED Single colour Green and Red; Value: LED 3 ly Single Colour
Q Q5 = BS250: P-Channel 45V 90mA _Ta_ 330mW _Ta_ Surface Mount SOT-23-3; MF: Boca Semiconductor; SnapEDA_Link: https://www.snapeda.com/parts/BS250/Boca%20Semiconductor/view-part/2723900/?ref=snap; Availability: Unavailable; MP: BS250; Price: None; Value: *; Package: TO-236-3 Boca Semiconductor
R26-R37 R39-R41 R43-R54 R56 R58 R59 R61 R62 R64-R71 = Resistor - SMD: as R1 on sheet [01] - Power; Published: 08/06/2000; Publisher: Altium Hobart Technology Centre
U9 U11 U13 U14 = LF347: as U7#1 on sheet [05] - Analog signal; Supplier 1: Digi-Key; Supplier Part Number 1: 296-7136-5-ND; Package / Case: 14-SOIC (3.9mm Width), 14-SOL; Supplier: Digi-Key; Current - Output / Channel: -; Packaging: Tube; RoHS: RoHS Compliant; Output Type: -; Operating Temperature: 0°C ~ 70°C; Category: Integrated Circuits (ICs); Supplier Part Number: 296-7136-5-ND
U10 U12 U15 U17-U19 = PC817: Single Opto; Value: PC817

## Sheet [08] - LCD and Keyboard.SchDoc
size A
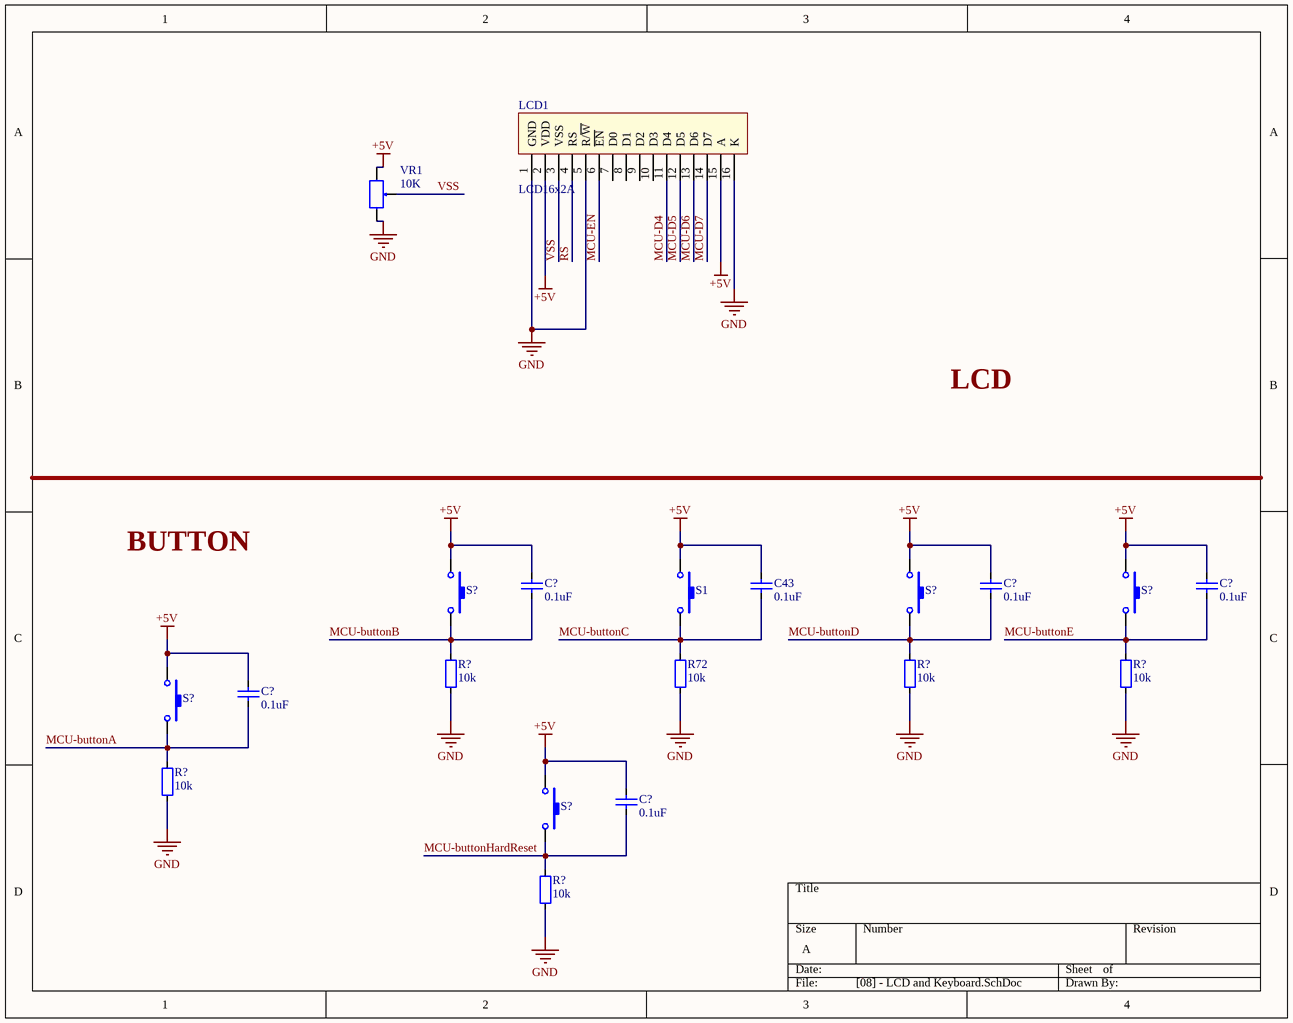
[diagram p8: [08] - LCD and Keyboard.SchDoc]

### Parts
(Parts that share a designator on the sheet are numbered #1, #2 ... from top to bottom, then left to right.)
C43  0.1uF  [CAP_0402]
C?#1  0.1uF  [CAP_0402]
C?#2  0.1uF  [CAP_0402]
C?#3  0.1uF  [CAP_0402]
C?#4  0.1uF  [CAP_0402]
C?#5  0.1uF  [CAP_0402]
LCD1  LCD16x2A  [LCD16X2]
R72  10k  [RES-SMD-0101]
R?#1  10k  [RES-SMD-0101]
R?#2  10k  [RES-SMD-0101]
R?#3  10k  [RES-SMD-0101]
R?#4  10k  [RES-SMD-0101]
R?#5  10k  [RES-SMD-0101]
S1  SW-SMD  [SW-SMD]  (value not drawn)
S?#1  SW-SMD  [SW-SMD]  (value not drawn)
S?#2  SW-SMD  [SW-SMD]  (value not drawn)
S?#3  SW-SMD  [SW-SMD]  (value not drawn)
S?#4  SW-SMD  [SW-SMD]  (value not drawn)
S?#5  SW-SMD  [SW-SMD]  (value not drawn)
VR1  10K  [VR]

### Nets
+5V: C43.2 C?#1.2 C?#2.2 C?#3.2 C?#4.2 C?#5.2 LCD1.2(VDD) LCD1.15(A) S1.1 S?#1.1 S?#2.1 S?#3.1 S?#4.1 S?#5.1 VR1.1
GND: LCD1.1(GND) LCD1.5(R/~{W}) LCD1.16(K) R72.2 R?#1.2 R?#2.2 R?#3.2 R?#4.2 R?#5.2 VR1.3
MCU-buttonA: C?#4.1 R?#4.1 S?#4.2
MCU-buttonB: C?#1.1 R?#1.1 S?#1.2
MCU-buttonC: C43.1 R72.1 S1.2
MCU-buttonD: C?#2.1 R?#2.1 S?#2.2
MCU-buttonE: C?#3.1 R?#3.1 S?#3.2
MCU-buttonHardReset: C?#5.1 R?#5.1 S?#5.2
MCU-D4: LCD1.11(D4)
MCU-D5: LCD1.12(D5)
MCU-D6: LCD1.13(D6)
MCU-D7: LCD1.14(D7)
MCU-EN: LCD1.6(~{EN})
RS: LCD1.4(RS)
VSS: LCD1.3(VSS) VR1.2

Not connected (* = marked no-connect by the designer): LCD1 7(D0) 8(D1) 9(D2) 10(D3)

### Notes on the sheet
- Labels drawn without touching a wire or pin: BUTTON, LCD

### Library data of the parts
C43 C?#1-C?#5 = CapSMD: Capacitor; Value: 33p; Published: 8-Jun-2000; LatestRevisionDate: 17-Jul-2002; LatestRevisionNote: Re-released for DXP Platform.; PackageReference: RAD-0.3; Publisher: Altium Limited
LCD1 = LCD16x2: LCD dipslay 16 char, 2 line; Value: LCD16x2A
R72 R?#1-R?#5 = Resistor - SMD: as R1 on sheet [01] - Power; Published: 08/06/2000; Publisher: Altium Hobart Technology Centre
S1 S?#1-S?#5 = SW-SMD: Switch; Published: 24-Mar-1999; LatestRevisionDate: 17-Jul-2002; LatestRevisionNote: Re-released for DXP Platform.; PackageReference: SPST-2; Publisher: Altium Limited
VR1 = VR: Var Resistor; Value: VR 10K

## Nets that join several sheets
+5V: [01] - Power (5 pins), [05] - Analog signal (12 pins), [03] - H bridge (R4.2 R7.2 U4.2 U6.2), [04] - Measure current (C16.1 IC2.8), [06] - Digital signal (R36.1 R41.1 R58.1 R61.1), [08] - LCD and Keyboard (15 pins)
+12V: [01] - Power (C3.2 L2.2 R1.2), [05] - Analog signal (6 pins), [03] - H bridge (D5.1 D6.1 U4.5 U6.5), [06] - Digital signal (U9.11 U11.11 U13.11 U14.11)
+24V: [03] - H bridge (D7.2 D8.2 Q1.2 Q2.2), [06] - Digital signal (Q.S Q5.S R69.2 R71.2)
GND: [01] - Power (15 pins), [02] - STM32 (8 pins), [05] - Analog signal (29 pins), [03] - H bridge (11 pins), [07] - RS485 (8 pins), [04] - Measure current (C16.2 C17.1 IC2.5), [06] - Digital signal (30 pins), [08] - LCD and Keyboard (10 pins)
VCC1: [01] - Power (C5.2 U2.2), [02] - STM32 (5 pins), [05] - Analog signal (?.11 ?.13), [07] - RS485 (6 pins), [06] - Digital signal (6 pins)